# EAGLE design bebox_spritzer (EAGLE 9.3.2)
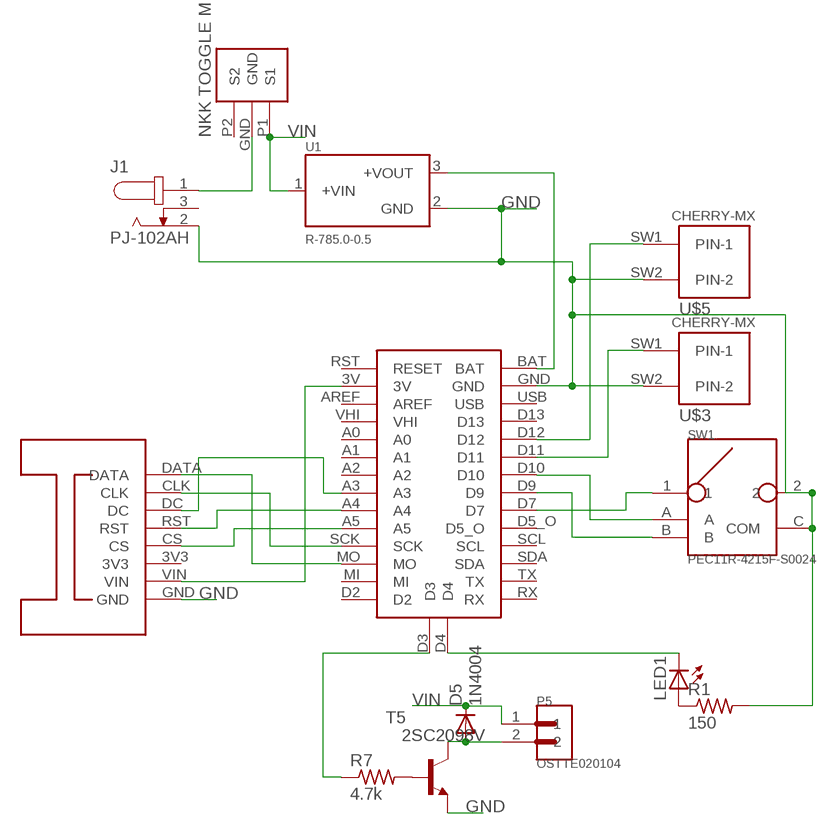
[diagram p0: schematic, sheet 1]

## Parts
D5  1N4004  [DO41-10]
J1  PJ-102AH  [CUI_PJ-102AH]
LED1  LED5MM  [LED5MM]
P5  OSTTE020104  [OST_OSTTE020104]
R1  150  R-US_0207/10  [0207/10]
R7  4.7k  R-US_0207/10  [0207/10]
SW1  PEC11R-4215F-S0024  [SW_PEC11R-4215F-S0024]
T5  2SC2098V  [TO220AV]
U1  R-785.0-0.5  [RECOM_R-785.0-0.5]
U$1  ITSYBITSYM4  [ITSYBITSYM4]
U$2  OLED_128X64  [OLED_128X64]
U$3  CHERRY-MX  [CHERRY-MX]
U$4  NKK_M2012S2A2A30  [NKK_M2012S2A2A30]
U$5  CHERRY-MX  [CHERRY-MX]

## Nets
GND: J1.2 R1.2 SW1.2 SW1.C(COM) T5.3(E) U1.2(GND) U$1.GND U$2.GND U$3.SW2(PIN-2) U$5.SW2(PIN-2)
N$1: LED1.A R1.1
N$2: R7.1 U$1.D3
N$3: LED1.K(C) U$1.D4
N$4: U$1.D12 U$5.SW1(PIN-1)
N$5: U$1.MO U$2.DATA
N$6: U$1.SCK U$2.CLK
N$7: U$1.A3 U$2.DC
N$8: U$1.A4 U$2.RST
N$9: U$1.A5 U$2.CS
N$10: R7.2 T5.1(B)
N$11: D5.A P5.2 T5.2(C)
N$12: U$1.3V U$2.VIN
N$13: SW1.A U$1.D10
N$14: U$1.D11 U$3.SW1(PIN-1)
N$15: SW1.B U$1.D9
N$16: SW1.1 U$1.D7
N$18: J1.1 U$4.GND
N$26: U1.3(+VOUT) U$1.BAT
VIN: D5.C P5.1 U1.1(+VIN) U$4.P1(S1)
Unconnected: J1.3 U$1.A0 U$1.A1 U$1.A2 U$1.AREF U$1.D2 U$1.D5_O U$1.D13 U$1.MI U$1.RST(RESET) U$1.RX U$1.SCL U$1.SDA U$1.TX U$1.USB U$1.VHI U$2.3V3 U$4.P2(S2)

## Library data of the parts
D5 = adafruit:1N4004: DIODE General purpose 1N400x type rectifier (With bigger pads) http://www.ladyada.net/library/pcb/eaglelibrary.html
J1 = PJ-102AH:PJ-102AH: 2.0 mm Center Pin, 5.0 A, Right Angle, Through Hole, Tapered Pins, Dc Power Jack Connector; MANUFACTURER: CUI INC; PART_REV: 1.02; STANDARD: Manufacturer recommendations
LED1 = led:LED: LED OSRAM: - CHIPLED LG R971, LG N971, LY N971, LG Q971, LY Q971, LO R971, LY R971 LH N974, LH R974 LS Q976, LO Q976, LY Q976 LO Q996 - Hyper CHIPLED LW Q18S LB Q993, LB Q99A, LB R99A - SideLED LS A670, LO A670, LY A670, LG A670, LP A670 LB A673, LV A673, LT A673, LW A673 LH A674 LY A675 LS A676, LA A676, LO A676, LY A676, LW A676 LS A679, LY A679, LG A679 - Hyper Micro SIDELED® LS Y876, LA Y876, LO Y876, LY Y876 LT Y87S - SmartLED LW L88C, LW L88S LB L89C, LB L89S, LG L890 LS L89K, LO L89K, LY L89K LS L896, LA L896, LO L896, LY L896 - TOPLED LS T670, LO T670, LY T670, LG T670, LP T670 LSG T670, LSP T670, LSY T670, LOP T670, LYG T670 LG T671, LOG T671, LSG T671 LB T673, LV T673, LT T673, LW T673 LH T674 LS T676, LA T676, LO T676, LY T676, LB T676, LH T676, LSB T676, LW T676 LB T67C, LV T67C, LT T67C, LS T67K, LO T67K, LY T67K, LW E67C LS E67B, LA E67B, LO E67B, LY E67B, LB E67C, LV E67C, LT E67C LW T67C LS T679, LY T679, LG T679 LS T770, LO T770, LY T770, LG T770, LP T770 LB T773, LV T773, LT T773, LW T773 LH T774 LS E675, LA E675, LY E675, LS T675 LS T776, LA T776, LO T776, LY T776, LB T776 LHGB T686 LT T68C, LB T68C - Hyper Mini TOPLED® LB M676 - Mini TOPLED Santana® LG M470 LS M47K, LO M47K, LY M47K Source: http://www.osram.convergy.de LUXEON: - LUMILED® LXK2-PW12-R00, LXK2-PW12-S00, LXK2-PW14-U00, LXK2-PW14-V00 LXK2-PM12-R00, LXK2-PM12-S00, LXK2-PM14-U00 LXK2-PE12-Q00, LXK2-PE12-R00, LXK2-PE12-S00, LXK2-PE14-T00, LXK2-PE14-U00 LXK2-PB12-K00, LXK2-PB12-L00, LXK2-PB12-M00, LXK2-PB14-N00, LXK2-PB14-P00, LXK2-PB14-Q00 LXK2-PR12-L00, LXK2-PR12-M00, LXK2-PR14-Q00, LXK2-PR14-R00 LXK2-PD12-Q00, LXK2-PD12-R00, LXK2-PD12-S00 LXK2-PH12-R00, LXK2-PH12-S00 LXK2-PL12-P00, LXK2-PL12-Q00, LXK2-PL12-R00 Source: www.luxeon.com KINGBRIGHT: KA-3528ASYC Source: www.kingbright.com
P5 = OSTTE020104:OSTTE020104: Terminal Block 3.5mm 2pos Pcb; DESCRIPTION: Terminal Block 3.5mm 2pos Pcb; DIGI-KEY_PART_NUMBER: ED2740-ND; DIGI-KEY_PURCHASE_URL: https://www.digikey.com/product-detail/en/on-shore-technology-inc/OSTTE020104/ED2740-ND/2351816?utm_source=snapeda&utm_medium=aggregator&utm_campaign=symbol; MF: On Shore; MP: OSTTE020104; PACKAGE: None
R1 R7 = rcl:R-US_: RESISTOR, American symbol; SPICEPREFIX: R
SW1 = PEC11R-4215F-S0024:PEC11R-4215F-S0024: Incremental Encoder, 12 Mm, Contact Rating 10 Ma - 5 Vdc; AVAILABILITY: Unavailable; DESCRIPTION: Incremental Encoder, 12 Mm, Contact Rating 10 Ma - 5 Vdc; MF: Bourns; MP: PEC11R-4215F-S0024; PACKAGE: None; PRICE: None
T5 = transistor:2SC2098: NPN Epitaxial Planar Transistor RF Power Amplivier Source: 2SC2098.pdf
U1 = R-785.0-0.5:R-785.0-0.5: Switching Regulator, 0.5 Amp, Sip 3, 5vsingle Output, High Efficiency; DESCRIPTION: Switching Regulator, 0.5 Amp, Sip 3, 5vsingle Output, High Efficiency; DIGI-KEY_PART_NUMBER: 945-1037-ND; DIGI-KEY_PURCHASE_URL: https://www.digikey.com/product-detail/en/recom-power/R-785.0-0.5/945-1037-ND/2256217?utm_source=snapeda&utm_medium=aggregator&utm_campaign=symbol; MF: Recom Power; MP: R-785.0-0.5; PACKAGE: SIP-3 Recom Power
U$1 = arthur:ITSYBITSYM4
U$2 = arthur:OLED_128X64
U$3 U$5 = cherrymx:CHERRY-MX: Cherry MX series keyswitch
U$4 = arthur:NKK_M2012S2A2A30

## Board
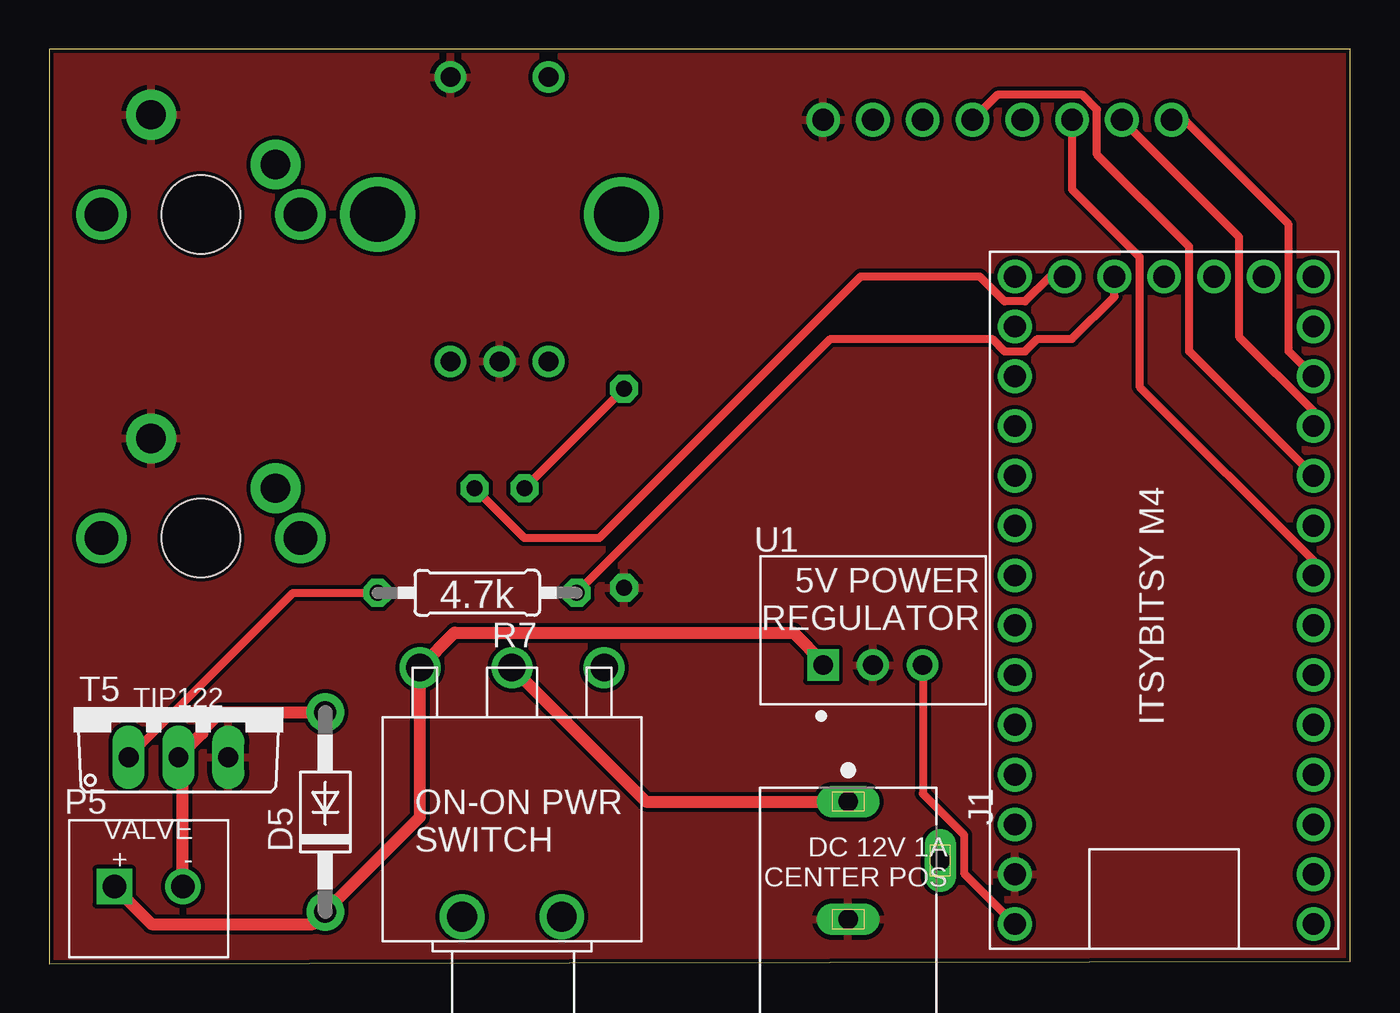
[diagram p1: board, top side]
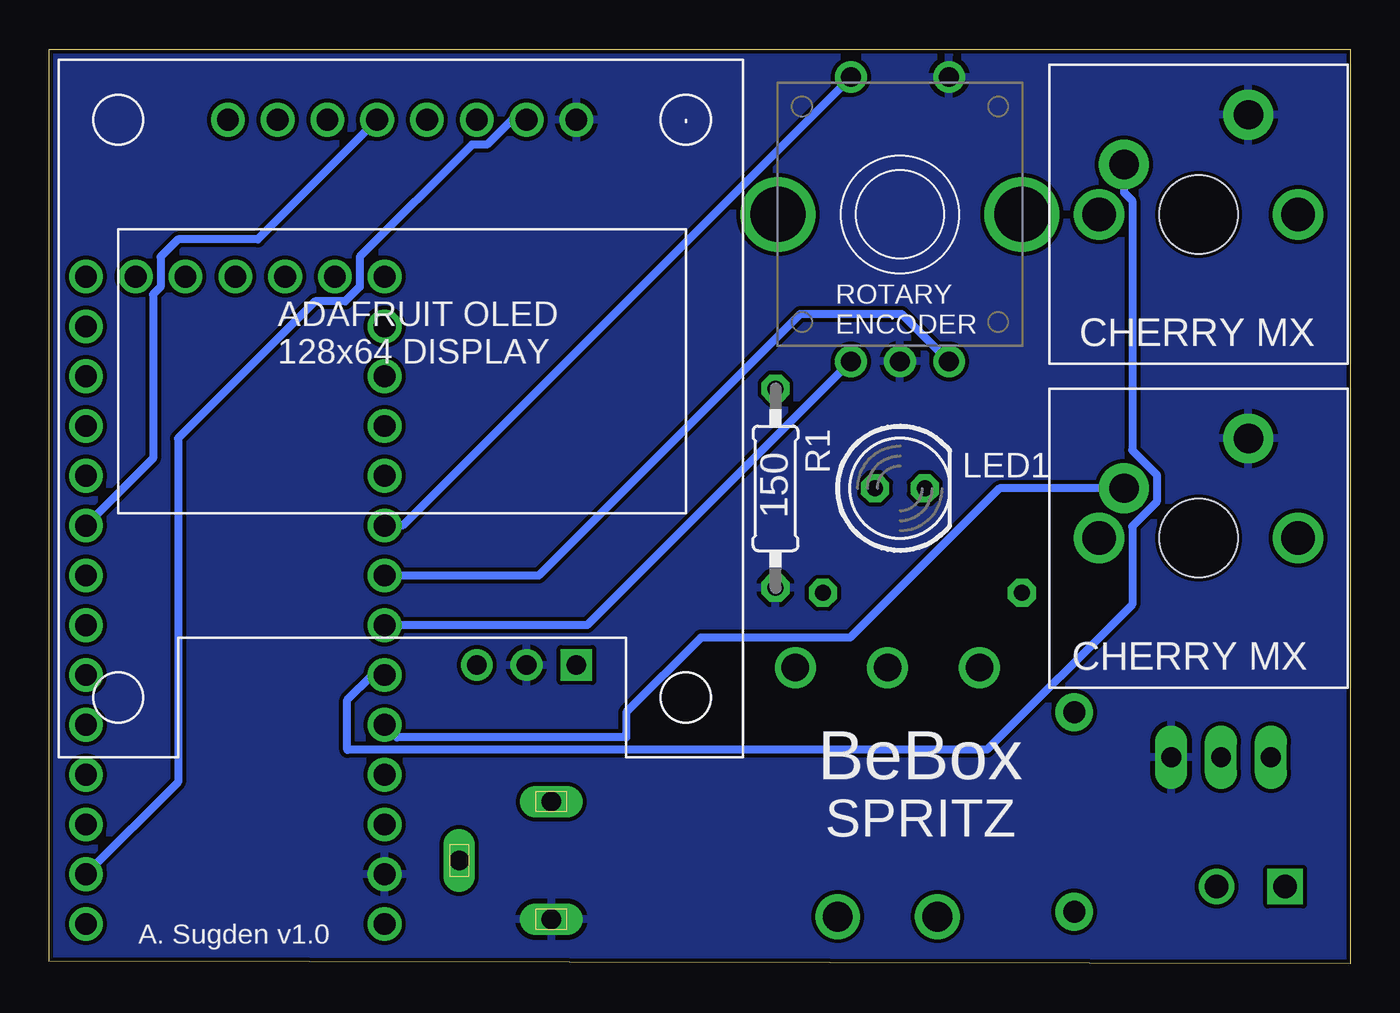
[diagram p2: board, bottom side, seen from below]

Size 66.4 x 46.66 mm. Coordinates in mm from the lower left corner, seen from the top.
Outline: 0,0 66.4,0.13 66.4,46.66 0,46.66 0,0
Copper layers (1*16): Top 0.035mm / dielectric 1.5mm / Bottom 0.035mm
Design rules "SparkFun": minimum track width 8mil, minimum drill 20mil, track to track 8mil, track to pad 8mil, pad to pad 8mil, via to via 8mil, smd to smd 8mil, copper to edge 8mil, drill to drill 8mil, minimum pad ring 12mil, minimum via ring 10mil, stop-mask expansion 4mil, vias tented up to drill 20mil, thermal gap 10mil

### Footprints (pad centres in the part's own frame; a part is rotated, then mirrored left to right if it is on the bottom)
DO41-10 = drill 1.118 pad 1.93: A 5.08,0; C -5.08,0
CUI_PJ-102AH = drill 1 long: 1 -6.5,0; 2 -0.5,0; 3 -3.5,4.7
LED5MM = drill 0.813 octagon: A -1.27,0; K 1.27,0
OST_OSTTE020104 = drill 1.2 square: 1 -1.75,0 | drill 1.2: 2 1.75,0
0207/10 = drill 0.813 octagon: 1 -5.08,0; 2 5.08,0
SW_PEC11R-4215F-S0024 = drill 1: 1 -2.5,7; 2 2.5,7; A -2.5,-7.5; B 2.5,-7.5; C 0,-7.5 | drill 2.794: P$1 -6.223,0; P$2 6.223,0
TO220AV = drill 1.016 long: 1 -2.54,-2.54; 2 0,-2.54; 3 2.54,-2.54
RECOM_R-785.0-0.5 = drill 1 square: 1 -2.54,-1.775 | drill 1: 2 0,-1.775; 3 2.54,-1.775
ITSYBITSYM4 = drill 1.11: 3V -12.7,-7.62; A0 -5.08,-7.62; A1 -2.54,-7.62; A2 0,-7.62; A3 2.54,-7.62; A4 5.08,-7.62; A5 7.62,-7.62; AREF -10.16,-7.62; BAT -15.24,7.62; D2 17.78,-7.62; D3 17.78,2.54; D4 17.78,5.08; D5_O 7.62,7.62; D7 5.08,7.62; D9 2.54,7.62; D10 0,7.62; D11 -2.54,7.62; D12 -5.08,7.62; D13 -7.62,7.62; GND -12.7,7.62; MI 15.24,-7.62; MO 12.7,-7.62; P$1 17.78,0; P$3 17.78,-2.54; P$4 17.78,-5.08; RST -15.24,-7.62; RX 17.78,7.62; SCK 10.16,-7.62; SCL 10.16,7.62; SDA 12.7,7.62; TX 15.24,7.62; USB -10.16,7.62; VHI -7.62,-7.62
OLED_128X64 = drill 1.11: 3V3 3.81,13.716; CLK -6.35,13.716; CS 1.27,13.716; DATA -8.89,13.716; DC -3.81,13.716; GND 8.89,13.716; RST -1.27,13.716; VIN 6.35,13.716
CHERRY-MX = drill 1.714 pad 1.93: P$3 -5.08,0; P$4 5.08,0 | drill 1.5 pad 2.54: SW1 -3.81,2.54; SW2 2.54,5.08 | hole 4: 0,0
NKK_M2012S2A2A30 = drill 1.397: GND 0,12.7; P1 -4.699,12.7; P2 4.699,12.7 | drill 1.524: P$1 -2.54,0; P$2 2.54,0

### Placement (x,y rotation side)
D5  14.1,7.75 90 top
J1  40.77,1.78 270 top
LED1  22.99,24.26 0 bottom
P5  5.08,3.94 0 top
R1  29.34,24.26 270 bottom
R7  21.84,18.92 180 top
SW1  22.99,38.23 0 bottom
T5  6.6,13.08 0 top
U1  42.04,17.02 0 top
U$1  56.9,17.27 90 top
U$2  48.39,29.34 0 bottom
U$3  7.75,38.23 0 bottom
U$4  23.62,2.41 0 top
U$5  7.75,21.72 0 bottom

### Tracks (layer width: path | path; a pad name or v marks a point on that pad's centre or on a via)
GND
  pour Bottom: -3.68,48.39 -3.68,-1.14 -2.41,-2.41 67.44,-2.41 69.98,0.13 69.98,47.12 68.71,48.39
  pour Top: -3.68,49.66 -3.68,-3.68 67.44,-3.68 69.98,-1.14 69.98,47.12 67.44,49.66
N$1
  Top 0.406: LED1.A R1.1
N$2
  Top 0.406: R7.1 39.88,31.88 48.12,31.88 48.75,31.25 49.8,31.25 50.43,31.88 52.2,31.88 54.36,34.04 U$1.D3
N$3
  Top 0.406: U$1.D4 51.07,35.05 49.8,33.79 48.75,33.79 47.48,35.05 41.4,35.05 28.07,21.72 24.26,21.72 LED1.K
N$4
  Bottom 0.406: U$5.SW1 17.91,24.26 25.53,16.64 33.15,16.64 36.96,12.83 36.96,11.56 48.64,11.56 U$1.D12
N$5
  Top 0.406: U$1.MO 63.25,31.24 63.25,37.72 57.91,43.05 U$2.DATA
N$6
  Top 0.406: U$2.CLK 60.71,37.08 60.71,31.99 64.52,28.18 U$1.SCK
N$7
  Top 0.406: U$2.DC 52.2,39.5 55.63,36.06 55.63,29.45 64.52,20.56 U$1.A3
N$8
  Bottom 0.406: U$2.RST 55.75,36.96 59.82,36.96 60.71,36.06 60.71,34.53 61.09,34.15 61.09,25.78 U$1.A4
N$9
  Top 0.406: U$1.A5 58.17,31.24 58.17,36.58 53.47,41.27 53.47,43.57 52.72,44.32 48.38,44.32 U$2.CS
N$10
  Top 0.406: T5.1 12.45,18.92 R7.2
N$11
  Top 0.61: P5.2 6.83,10.31 T5.2 7.82,11.76 7.82,11.9 8.75,12.83 D5.A
N$12
  Bottom 0.406: U$2.VIN 42.79,43.05 44.05,41.79 44.83,41.79 50.55,36.06 50.55,34.53 51.29,33.79 52.83,33.79 59.82,26.8 59.82,9.27 U$1.3V
N$13
  Bottom 0.406: SW1.A 38.94,17.27 U$1.D10
N$14
  Bottom 0.406: U$3.SW1 11.56,39.35 11.13,38.93 11.13,26.21 9.88,24.95 9.88,23.56 11.13,22.31 11.13,18.33 18.54,10.93 51.18,10.93 51.18,10.92 51.18,13.46 49.91,14.73 U$1.D11
N$15
  Bottom 0.406: U$1.D9 41.4,19.81 28.07,33.15 22.91,33.15 SW1.B
N$16
  Bottom 0.406: SW1.1 48.36,22.35 U$1.D7
N$18
  Top 0.61: U$4.GND 30.46,8.28 J1.1
N$26
  Top 0.406: U$1.BAT 46.68,4.63 46.68,6.59 44.58,8.69 U1.3
VIN
  Top 0.61: U1.1 39.5,15.37 37.97,16.89 20.7,16.89 U$4.P1 18.92,7.49 D5.C 13.46,2.03 5.23,2.03 P5.1

### Text on the board
tPlace: 5V POWER / REGULATOR | 4.7k | TIP122 | VALVE / + - | DC 12V 1A / CENTER POS
bPlace: ROTARY / ENCODER | CHERRY MX | 150 | CHERRY MX | BeBox | SPRITZ | A. Sugden v1.0